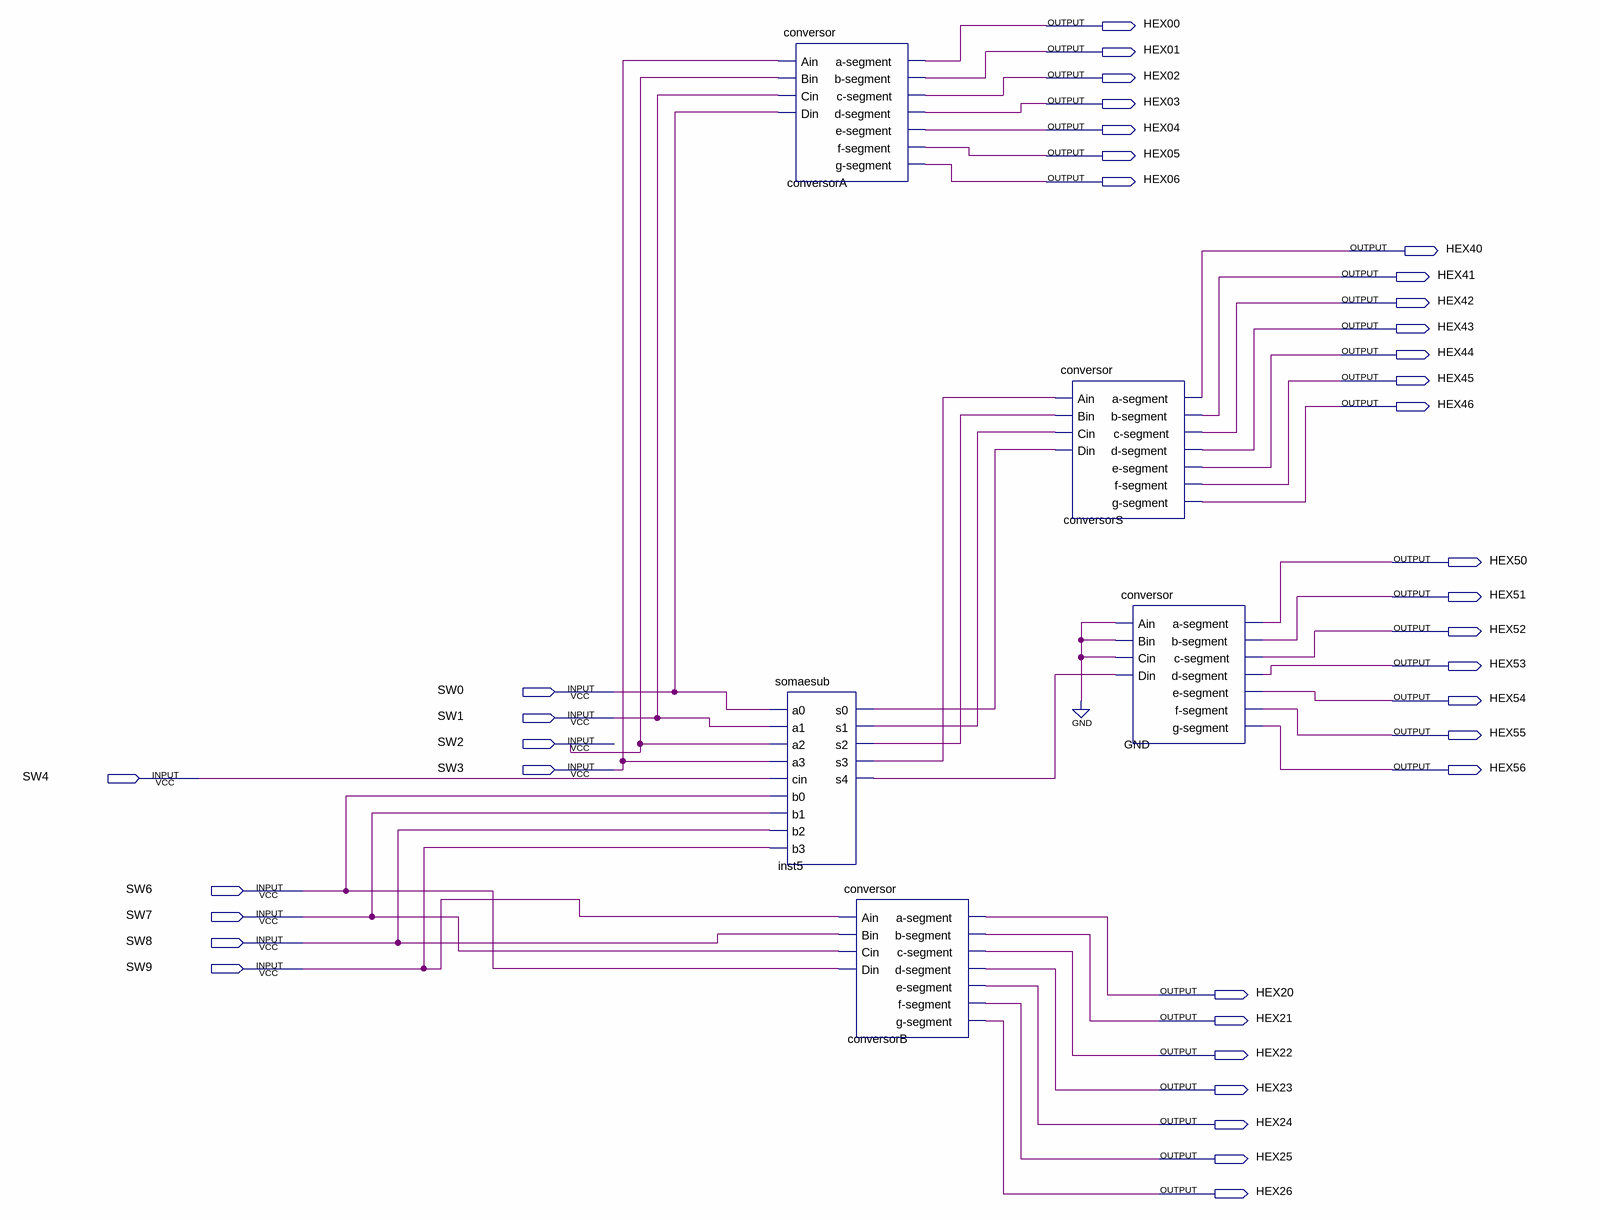
[diagram p0: schematic sheet]
// Quartus schematic adder_subtractor.bdf as structural Verilog: 5 symbols, 37 pins
module adder_subtractor (
  input  SW0,
  input  SW1,
  input  SW2,
  input  SW3,
  input  SW4,
  input  SW6,
  input  SW7,
  input  SW8,
  input  SW9,
  output HEX00,
  output HEX01,
  output HEX02,
  output HEX03,
  output HEX04,
  output HEX05,
  output HEX06,
  output HEX40,
  output HEX41,
  output HEX42,
  output HEX43,
  output HEX44,
  output HEX45,
  output HEX46,
  output HEX50,
  output HEX51,
  output HEX52,
  output HEX53,
  output HEX54,
  output HEX55,
  output HEX56,
  output HEX20,
  output HEX21,
  output HEX22,
  output HEX23,
  output HEX24,
  output HEX25,
  output HEX26
);

  wire inst5_s0, inst5_s1, inst5_s2, inst5_s3, inst5_s4;

  conversor conversorA (
    .Ain(SW3), .Bin(SW2), .Cin(SW1), .Din(SW0), .\a-segment (HEX00), .\b-segment (HEX01),
    .\c-segment (HEX02), .\d-segment (HEX03), .\e-segment (HEX04), .\f-segment (HEX05), .\g-segment (HEX06));
  somaesub inst5 (
    .a0(SW0), .a1(SW1), .a2(SW2), .a3(SW3), .cin(SW4), .b0(SW6), .b1(SW7), .b2(SW8), .b3(SW9), .s0(inst5_s0),
    .s1(inst5_s1), .s2(inst5_s2), .s3(inst5_s3), .s4(inst5_s4));
  conversor conversorB (
    .Ain(SW9), .Bin(SW8), .Cin(SW7), .Din(SW6), .\a-segment (HEX20), .\b-segment (HEX21),
    .\c-segment (HEX22), .\d-segment (HEX23), .\e-segment (HEX24), .\f-segment (HEX25), .\g-segment (HEX26));
  conversor conversorS (
    .Ain(inst5_s3), .Bin(inst5_s2), .Cin(inst5_s1), .Din(inst5_s0), .\a-segment (HEX40), .\b-segment (HEX41),
    .\c-segment (HEX42), .\d-segment (HEX43), .\e-segment (HEX44), .\f-segment (HEX45), .\g-segment (HEX46));
  conversor GND (
    .Ain(1'b0), .Bin(1'b0), .Cin(1'b0), .Din(inst5_s4), .\a-segment (HEX50), .\b-segment (HEX51),
    .\c-segment (HEX52), .\d-segment (HEX53), .\e-segment (HEX54), .\f-segment (HEX55), .\g-segment (HEX56));
endmodule
